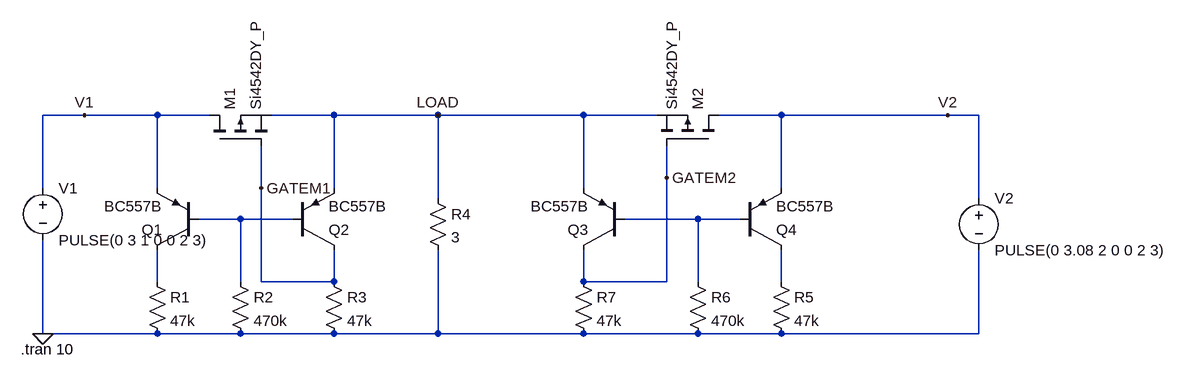
[diagram p0: schematic Ideal_Diode.asc]
Ideal_Diode.asc, the LTspice schematic file:
Version 4
SHEET 1 1668 680
WIRE -32 -16 -96 -16
WIRE 80 -16 -32 -16
WIRE 160 -16 80 -16
WIRE 352 -16 256 -16
WIRE 512 -16 352 -16
WIRE 736 -16 512 -16
WIRE 848 -16 736 -16
WIRE 1040 -16 944 -16
WIRE 1296 -16 1040 -16
WIRE 1344 -16 1296 -16
WIRE 864 80 864 32
WIRE -96 96 -96 -16
WIRE 80 96 80 -16
WIRE 240 96 240 32
WIRE 352 96 352 -16
WIRE 736 96 736 -16
WIRE 1040 96 1040 -16
WIRE 512 112 512 -16
WIRE 1344 112 1344 -16
WIRE 208 144 144 144
WIRE 288 144 208 144
WIRE 912 144 800 144
WIRE 976 144 912 144
WIRE 80 240 80 192
WIRE 208 240 208 144
WIRE 240 240 240 96
WIRE 352 240 352 192
WIRE 352 240 240 240
WIRE 736 240 736 192
WIRE 864 240 864 80
WIRE 864 240 736 240
WIRE 912 240 912 144
WIRE 1040 240 1040 192
WIRE -96 320 -96 176
WIRE 80 320 -96 320
WIRE 208 320 80 320
WIRE 352 320 208 320
WIRE 512 320 512 192
WIRE 512 320 352 320
WIRE 736 320 512 320
WIRE 912 320 736 320
WIRE 1040 320 912 320
WIRE 1344 320 1344 192
WIRE 1344 320 1040 320
FLAG -96 320 0
FLAG -32 -16 V1
FLAG 512 -16 LOAD
FLAG 240 96 GATEM1
FLAG 1296 -16 V2
FLAG 864 80 GATEM2
SYMBOL pnp 144 192 R180
SYMATTR InstName Q1
SYMATTR Value BC557B
SYMBOL pnp 288 192 M180
SYMATTR InstName Q2
SYMATTR Value BC557B
SYMBOL res 64 224 R0
SYMATTR InstName R1
SYMATTR Value 47k
SYMBOL res 192 224 R0
SYMATTR InstName R2
SYMATTR Value 470k
SYMBOL res 336 224 R0
SYMATTR InstName R3
SYMATTR Value 47k
SYMBOL pmos 160 32 R270
SYMATTR InstName M1
SYMATTR Value Si4542DY_P
SYMBOL voltage -96 80 R0
WINDOW 123 0 0 Left 2
WINDOW 39 0 0 Left 2
SYMATTR InstName V1
SYMATTR Value PULSE(0 3 1 0 0 2 3)
SYMBOL res 496 96 R0
SYMATTR InstName R4
SYMATTR Value 3
SYMBOL voltage 1344 96 R0
WINDOW 123 0 0 Left 2
WINDOW 39 0 0 Left 2
SYMATTR InstName V2
SYMATTR Value PULSE(0 3.08 2 0 0 2 3)
SYMBOL pmos 944 32 M270
SYMATTR InstName M2
SYMATTR Value Si4542DY_P
SYMBOL pnp 800 192 R180
SYMATTR InstName Q3
SYMATTR Value BC557B
SYMBOL pnp 976 192 M180
SYMATTR InstName Q4
SYMATTR Value BC557B
SYMBOL res 1024 224 R0
SYMATTR InstName R5
SYMATTR Value 47k
SYMBOL res 896 224 R0
SYMATTR InstName R6
SYMATTR Value 470k
SYMBOL res 720 224 R0
SYMATTR InstName R7
SYMATTR Value 47k
TEXT -130 344 Left 2 !.tran 10

The netlist it stands for:
* Ideal_Diode.asc
Q1 N003 N001 V1 0 BC557B
Q2 GATEM1 N001 LOAD 0 BC557B
R1 N003 0 47k
R2 N001 0 470k
R3 GATEM1 0 47k
M1 V1 GATEM1 LOAD LOAD Si4542DY_P
V1 V1 0 PULSE(0 3 1 0 0 2 3)
R4 LOAD 0 3
V2 V2 0 PULSE(0 3.08 2 0 0 2 3)
M2 V2 GATEM2 LOAD LOAD Si4542DY_P
Q3 GATEM2 N002 LOAD 0 BC557B
Q4 N004 N002 V2 0 BC557B
R5 N004 0 47k
R6 N002 0 470k
R7 GATEM2 0 47k
.model NPN NPN
.model PNP PNP
.lib standard.bjt
.model NMOS NMOS
.model PMOS PMOS
.lib standard.mos
.tran 10
.backanno
.end

* Results of the author's LTspice run, read from the files saved beside the schematic
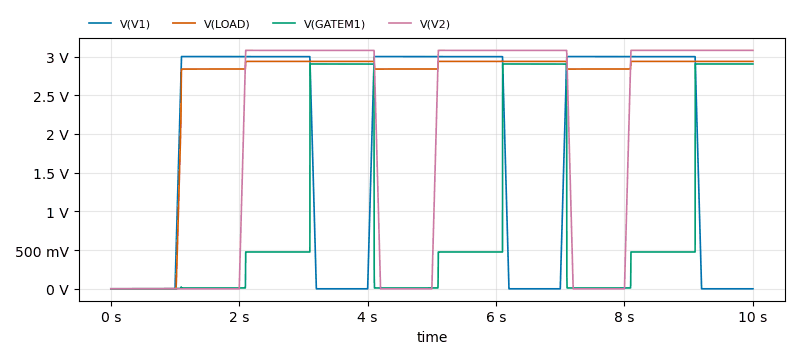
[diagram p1: Transient Analysis of Ideal_Diode.asc, plotted from the saved traces]
* Transient Analysis, 1 run:
*   V(V1): min 0 V, max 3 V, average 1.89 V, rms 2.364 V, last 0 V
*   V(LOAD): min 0 V, max 2.938 V, average 2.595 V, rms 2.743 V, last 2.937 V
*   V(GATEM1): min 0 V, max 2.904 V, average 987.3 mV, rms 1.584 V, last 2.904 V
*   V(V2): min 0 V, max 3.08 V, average 1.894 V, rms 2.4 V, last 3.08 V